# Altium schematic sheet adc_oscillator.SchDoc: ADC Oscillator
size A4
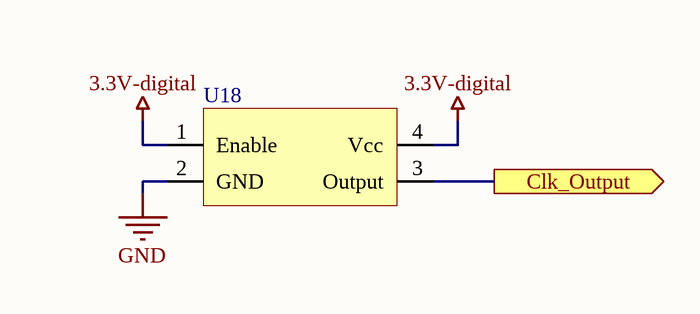
[diagram p0: adc_oscillator.SchDoc]

## Parts
U18  Ceramic Crystal  [2.0 x 2.5 mm]  (value not drawn)

## Ports
Clk_Output (out)

## Nets
3.3V-digital: U18.1(Enable) U18.4(Vcc)
GND: U18.2(GND)
Clk_Output: U18.3(Output) ; port Clk_Output

## Notes on the sheet
- Title:
- Sheet:
- of
- Author:
- Model:
- Document Number:
- Checked by:
- Iss-Rev:
- Approved by:
- Date:
- File name:

## Library data of the parts
U18 = ISM95-3251AH1.0000: Ceramic Crystal 1 MHz, A-Grade 25 ppm/deg